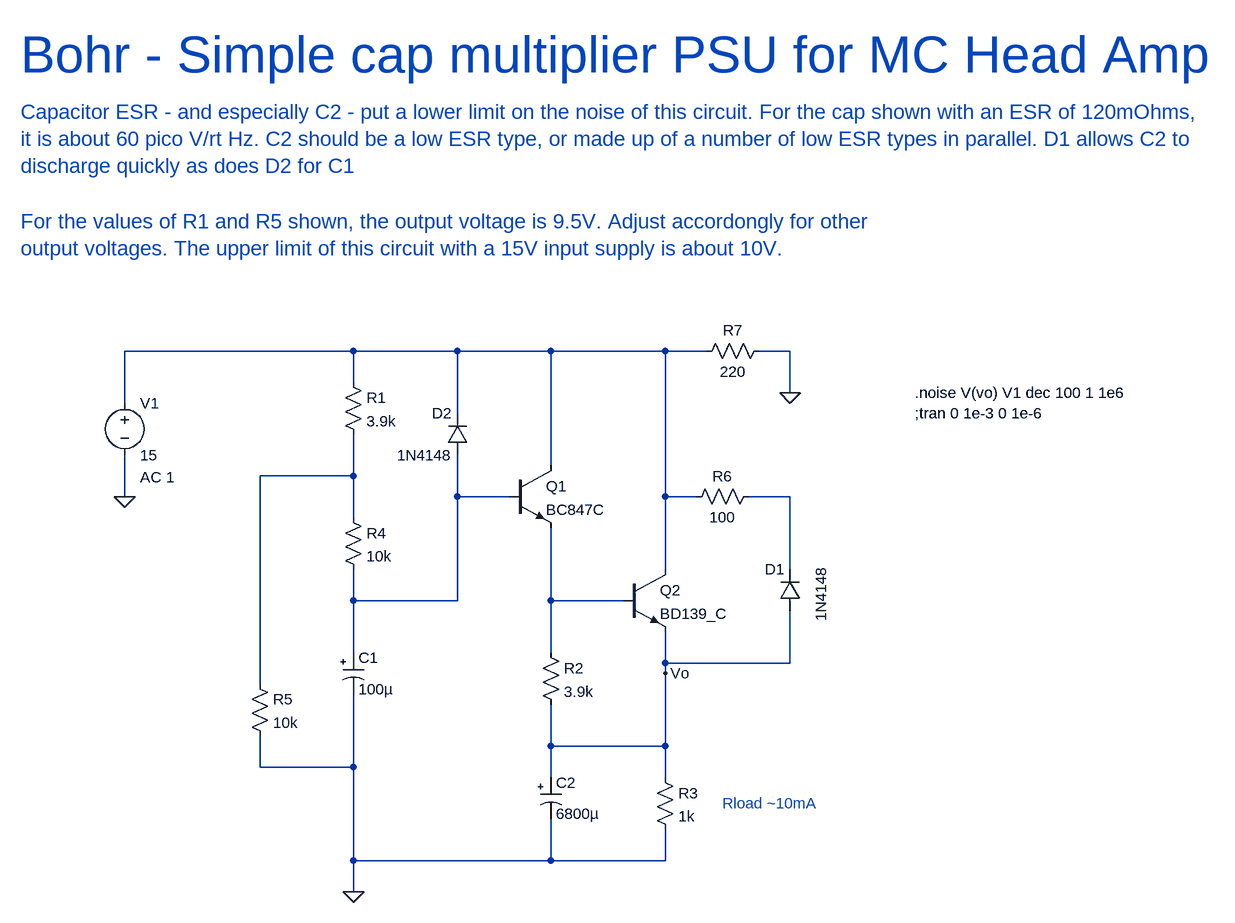
[diagram p0: schematic Bohr.asc]
Bohr.asc, the LTspice schematic file:
Version 4
SHEET 1 2000 952
WIRE 96 96 -256 96
WIRE 256 96 96 96
WIRE 400 96 256 96
WIRE 576 96 400 96
WIRE 640 96 576 96
WIRE 768 96 720 96
WIRE 96 144 96 96
WIRE 768 160 768 96
WIRE -256 176 -256 96
WIRE 256 192 256 96
WIRE 400 272 400 96
WIRE 96 288 96 224
WIRE 96 288 -48 288
WIRE -256 320 -256 256
WIRE 256 320 256 256
WIRE 336 320 256 320
WIRE 576 320 576 96
WIRE 624 320 576 320
WIRE 768 320 704 320
WIRE 96 352 96 288
WIRE 576 432 576 320
WIRE 768 432 768 320
WIRE 96 480 96 432
WIRE 256 480 256 320
WIRE 256 480 96 480
WIRE 400 480 400 368
WIRE 512 480 400 480
WIRE 96 560 96 480
WIRE 400 560 400 480
WIRE 576 576 576 528
WIRE 768 576 768 496
WIRE 768 576 576 576
WIRE 576 592 576 576
WIRE -48 608 -48 288
WIRE 400 704 400 640
WIRE 576 704 576 592
WIRE 576 704 400 704
WIRE -48 736 -48 688
WIRE 96 736 96 624
WIRE 96 736 -48 736
WIRE 400 752 400 704
WIRE 576 752 576 704
WIRE 96 880 96 736
WIRE 400 880 400 816
WIRE 400 880 96 880
WIRE 576 880 576 832
WIRE 576 880 400 880
WIRE 96 928 96 880
FLAG -256 320 0
FLAG 96 928 0
FLAG 576 592 Vo
FLAG 768 160 0
SYMBOL res 80 128 R0
SYMATTR InstName R1
SYMATTR Value 3.9k
SYMBOL npn 336 272 R0
SYMATTR InstName Q1
SYMATTR Value BC847C
SYMBOL npn 512 432 R0
SYMATTR InstName Q2
SYMATTR Value BD139_C
SYMBOL res 384 544 R0
SYMATTR InstName R2
SYMATTR Value 3.9k
SYMBOL voltage -256 160 R0
WINDOW 123 24 130 Left 2
WINDOW 39 0 0 Left 2
SYMATTR Value2 AC 1
SYMATTR InstName V1
SYMATTR Value 15
SYMBOL res 560 736 R0
SYMATTR InstName R3
SYMATTR Value 1k
SYMBOL res 80 336 R0
SYMATTR InstName R4
SYMATTR Value 10k
SYMBOL res -64 592 R0
SYMATTR InstName R5
SYMATTR Value 10k
SYMBOL polcap 384 752 R0
WINDOW 3 24 56 Left 2
SYMATTR Value 6800µ
SYMATTR InstName C2
SYMATTR Description Capacitor
SYMATTR Type cap
SYMATTR SpiceLine V=16 Irms=2.9 Rser=0.018 Lser=0 mfg="Nichicon" pn="UPL1C682MRH" type="Al electrolytic"
SYMBOL diode 784 496 R180
WINDOW 0 24 64 Left 2
WINDOW 3 -32 -16 VRight 2
SYMATTR InstName D1
SYMATTR Value 1N4148
SYMBOL polcap 80 560 R0
WINDOW 3 24 56 Left 2
SYMATTR Value 100µ
SYMATTR InstName C1
SYMATTR Description Capacitor
SYMATTR Type cap
SYMATTR SpiceLine V=16 Irms=265m Rser=0.35 Lser=0 mfg="Nichicon" pn="UPL1C101MPH" type="Al electrolytic"
SYMBOL diode 272 256 R180
WINDOW 0 24 64 Left 2
WINDOW 3 24 0 Left 2
SYMATTR InstName D2
SYMATTR Value 1N4148
SYMBOL res 720 304 R90
WINDOW 0 0 56 VBottom 2
WINDOW 3 32 56 VTop 2
SYMATTR InstName R6
SYMATTR Value 100
SYMBOL res 736 80 R90
WINDOW 0 0 56 VBottom 2
WINDOW 3 32 56 VTop 2
SYMATTR InstName R7
SYMATTR Value 220
TEXT -416 -360 Left 6 ;Bohr - Simple cap multiplier PSU for MC Head Amp
TEXT 664 792 Left 2 ;Rload ~10mA
TEXT 960 160 Left 2 !.noise V(vo) V1 dec 100 1 1e6
TEXT -416 -272 Left 3 ;Capacitor ESR - and especially C2 - put a lower limit on the noise of this circuit. For the cap shown with an ESR of 120mOhms, \nit is about 60 pico V/rt Hz. C2 should be a low ESR type, or made up of a number of low ESR types in parallel. D1 allows C2 to\ndischarge quickly as does D2 for C1
TEXT 960 192 Left 2 !;tran 0 1e-3 0 1e-6
TEXT -416 -104 Left 3 ;For the values of R1 and R5 shown, the output voltage is 9.5V. Adjust accordongly for other\noutput voltages. The upper limit of this circuit with a 15V input supply is about 10V.

The netlist it stands for:
* Bohr.asc
R1 N001 N002 3.9k
Q1 N001 N003 N005 0 BC847C
Q2 N001 N005 Vo 0 BD139_C
R2 N005 Vo 3.9k
V1 N001 0 15 AC 1
R3 Vo 0 1k
R4 N002 N003 10k
R5 N002 0 10k
C2 Vo 0 6800µ V=16 Irms=2.9 Rser=0.018 Lser=0 mfg="Nichicon" pn="UPL1C682MRH" type="Al electrolytic"
D1 Vo N004 1N4148
C1 N003 0 100µ V=16 Irms=265m Rser=0.35 Lser=0 mfg="Nichicon" pn="UPL1C101MPH" type="Al electrolytic"
D2 N003 N001 1N4148
R6 N004 N001 100
R7 0 N001 220
.model D D
.lib standard.dio
.model NPN NPN
.model PNP PNP
.lib standard.bjt
* Bohr - Simple cap multiplier PSU for MC Head Amp
* Rload ~10mA
.noise V(vo) V1 dec 100 1 1e6
* Capacitor ESR - and especially C2 - put a lower limit on the noise of this circuit. For the cap shown with an ESR of 120mOhms,
* it is about 60 pico V/rt Hz. C2 should be a low ESR type, or made up of a number of low ESR types in parallel. D1 allows C2 to
* discharge quickly as does D2 for C1
;tran 0 1e-3 0 1e-6
* For the values of R1 and R5 shown, the output voltage is 9.5V. Adjust accordongly for other
* output voltages. The upper limit of this circuit with a 15V input supply is about 10V.
.backanno
.end